# Altium schematic sheet IMU.SchDoc
size A4; SheetNumber: 3; SheetTotal: 5
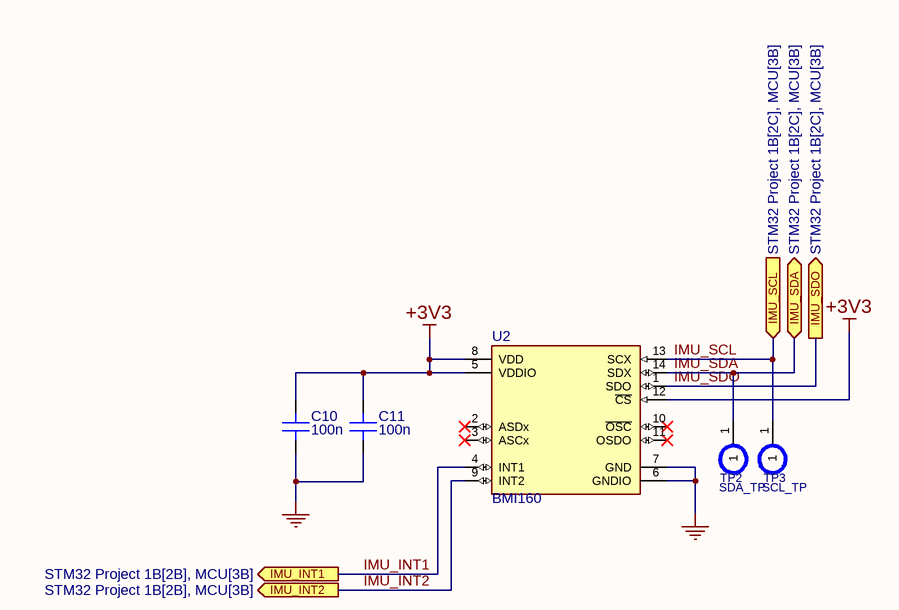
[diagram p0: IMU.SchDoc]

## Parts
C10  100n  [CAP_0805]
C11  100n  [CAP_0805]
TP2  SDA_TP  [TEST_POINT_SMD]  (no BOM)
TP3  SCL_TP  [TEST_POINT_SMD]  (no BOM)
U2  BMI160  [BMI160]

## Ports
IMU_INT1 (out, see STM32 Project 1B[2B], MCU[3B]), IMU_INT2 (out, see STM32 Project 1B[2B], MCU[3B]), IMU_SCL (in, see STM32 Project 1B[2C], MCU[3B]), IMU_SDA (bidir, see STM32 Project 1B[2C], MCU[3B]), IMU_SDO (out, see STM32 Project 1B[2C], MCU[3B])

## Nets
+3V3: C10.2 C11.2 U2.5(VDDIO) U2.8(VDD) U2.12(~{CS})
GND: C10.1 C11.1 U2.6(GNDIO) U2.7(GND)
IMU_INT1: U2.4(INT1) ; port IMU_INT1
IMU_INT2: U2.9(INT2) ; port IMU_INT2
IMU_SCL: TP3.1 U2.13(SCX) ; port IMU_SCL
IMU_SDA: TP2.1 U2.14(SDX) ; port IMU_SDA
IMU_SDO: U2.1(SDO) ; port IMU_SDO

Not connected (* = marked no-connect by the designer): U2 2(ASDx)* 3(ASCx)* 10(~{OSC})* 11(OSDO)*

## Library data of the parts
C10 C11 = CAP_0805: Capacitor SMD 0805 Generic; Manufacturer: *; Manufacturer Part Number: *; Tolerance: *; Voltage Rating: *; Dielectric: *
TP2 TP3 = TEST_POINT_SMD: Test Point SMD Generic - for in circuit test
U2 = BMI160: IMU ACCEL/GYRO I2C/SPI 14LGA; Sensor Type: Accelerometer; Output Type: SPI; Mount: Surface Mount; Max Operating Temperature: 85°C; Case/Package: LGA; Min Operating Temperature: -40°C; Packaging: Cut Tape; Lead Free: Lead Free